# EAGLE design NIRGM V5 (EAGLE 8.5.1)

## Sheet 1 of 7: Voltage Regulator
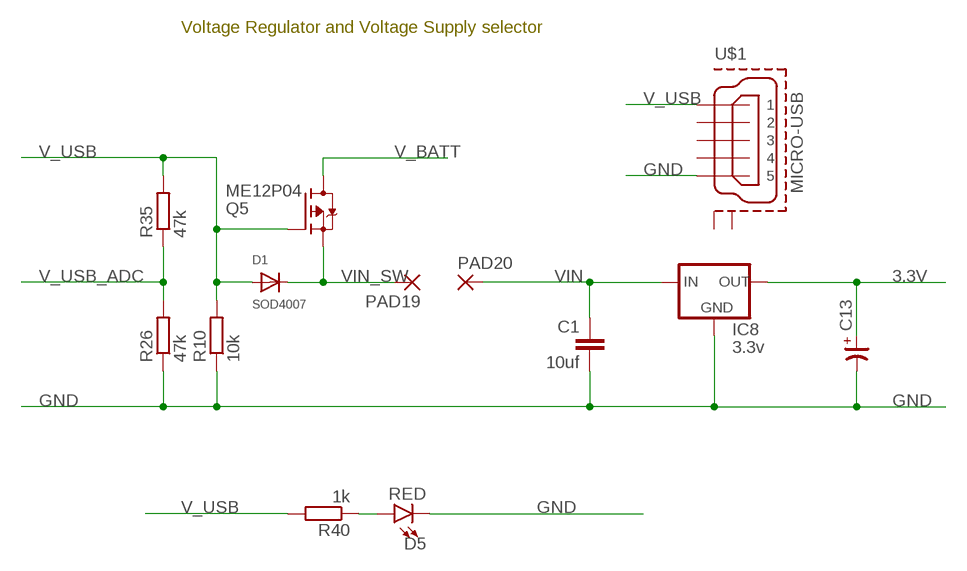
[diagram p0: schematic, sheet 1]

### Parts
C1  10uf  C-EUC1206K  [C1206K]
C13  CP-7343  [7343/T]
D1  SOD4007  DIODE_SOD-123FL  [SOD-123FL]
D5  RED  LED-GREEN1206  [LED-1206]
IC8  3.3v  LM1117TO252  [TO252]
PAD19  SMD2  [SMD1,27-2,54]
PAD20  SMD2  [SMD1,27-2,54]
Q5  ME12P04  FDD4141TO252  [TO252]
R10  10k  R-EU_R1206  [R1206]
R26  47k  R-EU_R1206  [R1206]
R35  47k  R-EU_R1206  [R1206]
R40  1k  R-EU_R1206  [R1206]
U$1  MICRO-USB  MICRO-USB-RECEPTACLE47589-0001  [47589-0001]

### Nets
3.3V: C13.+ IC8.3(OUT) ; also sheet 3,4,5,6,7
GND: C1.2 C13.- D5.C IC8.1(GND) R10.1 R26.1 U$1.5 ; also sheet 2,3,4,5,6,7
N$1: D5.A R40.1
V_BATT: Q5.3(D) ; also sheet 2,6
V_USB: D1.A Q5.1(G) R10.2 R35.2 R40.2 U$1.1 ; also sheet 2
V_USB_ADC: R26.2 R35.1 ; also sheet 4
VIN: C1.1 IC8.2(IN) PAD20.1(P)
VIN_SW: D1.C PAD19.1(P) Q5.2(S)
Unconnected: U$1.2 U$1.3 U$1.4 U$1.P$1(GND1) U$1.P$2(GND2)

### Notes on the sheet
- Voltage Regulator and Voltage Supply selector

## Sheet 2 of 7: Lithium-Polymer Battery Charger (1-cell)
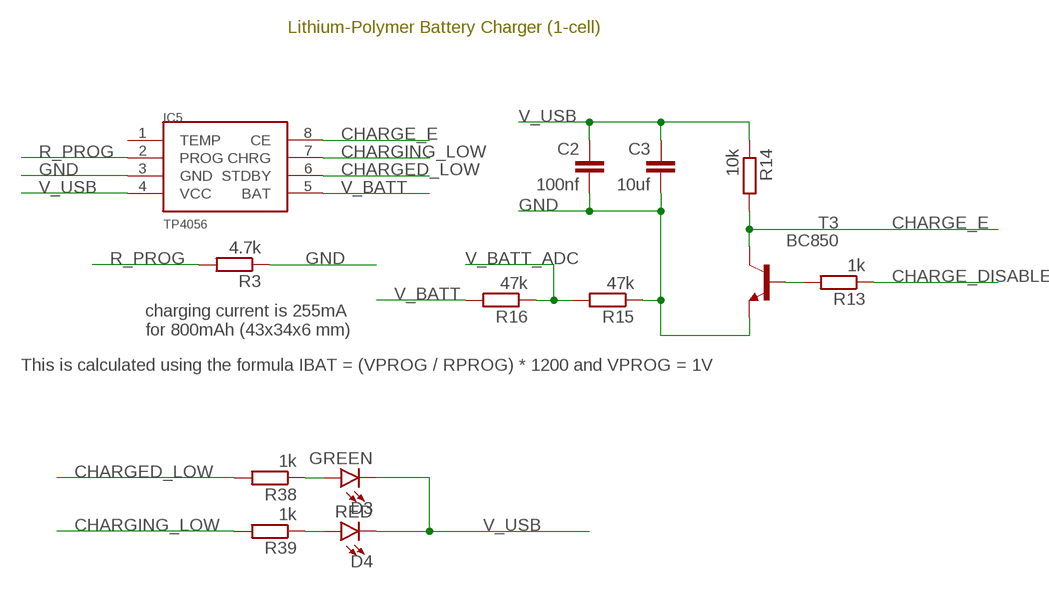
[diagram p1: schematic, sheet 2]

### Parts
C2  100nf  C-EUC1206K  [C1206K]
C3  10uf  C-EUC1206K  [C1206K]
D3  GREEN  LED-GREEN1206  [LED-1206]
D4  RED  LED-GREEN1206  [LED-1206]
IC5  TP4056  [SOP-8]
R3  4.7k  R-EU_R1206  [R1206]
R13  1k  R-EU_R1206  [R1206]
R14  10k  R-EU_R1206  [R1206]
R15  47k  R-EU_R1206  [R1206]
R16  47k  R-EU_R1206  [R1206]
R38  1k  R-EU_R1206  [R1206]
R39  1k  R-EU_R1206  [R1206]
T3  BC850  [SOT23]

### Nets
CHARGE_DISABLE: R13.1 ; also sheet 4
CHARGE_E: IC5.8(CE) R14.2 T3.3(C)
CHARGED_LOW: IC5.6(STDBY) R38.2 ; also sheet 4
CHARGING_LOW: IC5.7(CHRG) R39.2 ; also sheet 4
GND: C2.2 C3.2 IC5.3(GND) R3.1 R15.1 T3.2(E) ; also sheet 1,3,4,5,6,7
N$4: D3.A R38.1
N$6: D4.A R39.1
N$13: R13.2 T3.1(B)
R_PROG: IC5.2(PROG) R3.2
V_BATT: IC5.5(BAT) R16.2 ; also sheet 1,6
V_BATT_ADC: R15.2 R16.1 ; also sheet 4
V_USB: C2.1 C3.1 D3.C D4.C IC5.4(VCC) R14.1 ; also sheet 1
Unconnected: IC5.1(TEMP)

### Notes on the sheet
- Lithium-Polymer Battery Charger (1-cell)
- charging current is 255mA
  for 800mAh (43x34x6 mm)
- This is calculated using the formula IBAT = (VPROG / RPROG) * 1200 and VPROG = 1V

## Sheet 3 of 7: LED Driver
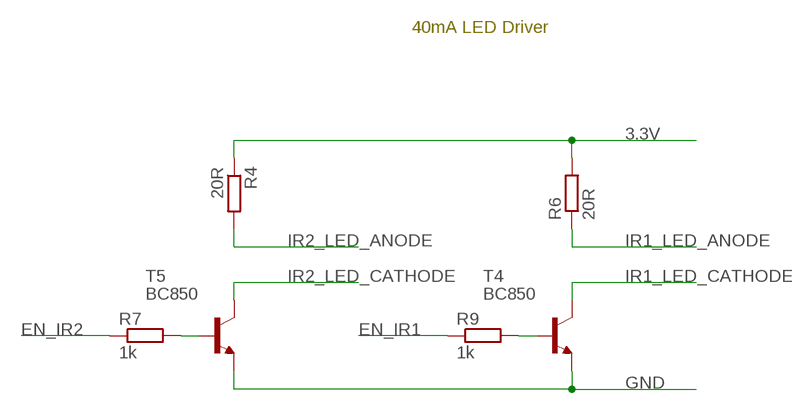
[diagram p2: schematic, sheet 3]

### Parts
R4  20R  R-EU_R1206  [R1206]
R6  20R  R-EU_R1206  [R1206]
R7  1k  R-EU_R1206  [R1206]
R9  1k  R-EU_R1206  [R1206]
T4  BC850  [SOT23]
T5  BC850  [SOT23]

### Nets
3.3V: R4.1 R6.2 ; also sheet 1,4,5,6,7
EN_IR1: R9.1 ; also sheet 4
EN_IR2: R7.1 ; also sheet 4
GND: T4.2(E) T5.2(E) ; also sheet 1,2,4,5,6,7
IR1_LED_ANODE: R6.1 ; also sheet 6
IR1_LED_CATHODE: T4.3(C) ; also sheet 6
IR2_LED_ANODE: R4.2 ; also sheet 6
IR2_LED_CATHODE: T5.3(C) ; also sheet 6
N$3: R7.2 T5.1(B)
N$8: R9.2 T4.1(B)

### Notes on the sheet
- 40mA LED Driver

## Sheet 4 of 7: ESP32
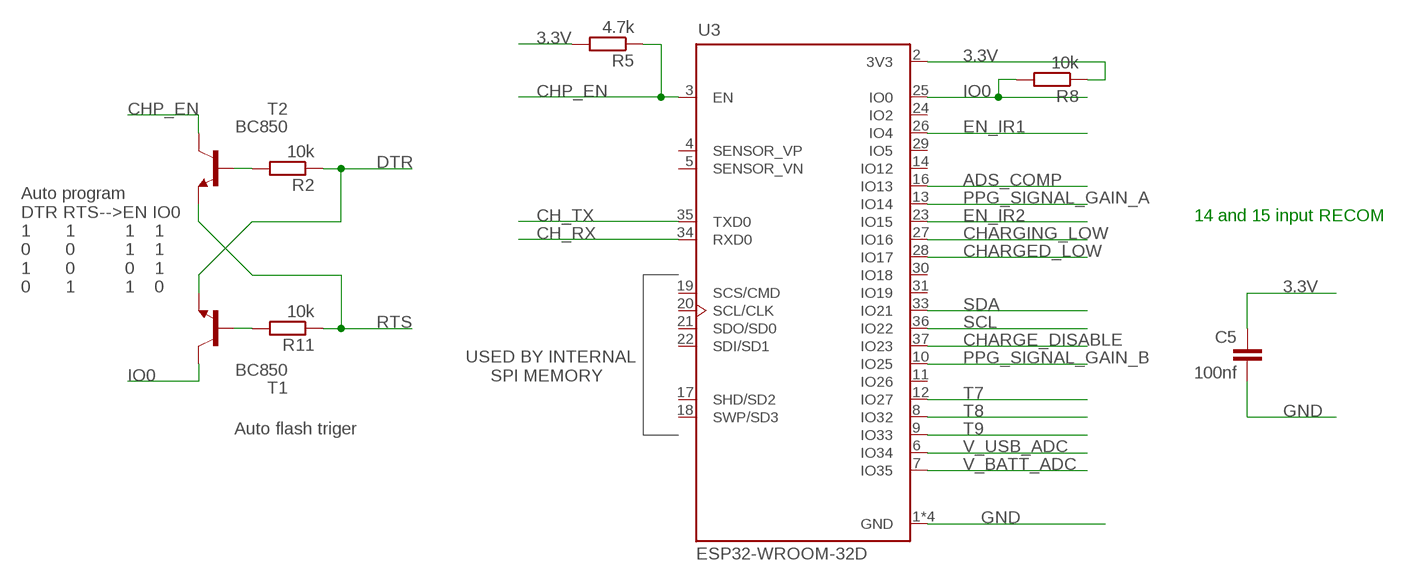
[diagram p3: schematic, sheet 4]

### Parts
C5  100nf  C-EUC1206K  [C1206K]
R2  10k  R-EU_R1206  [R1206]
R5  4.7k  R-EU_R1206  [R1206]
R8  10k  R-EU_R1206  [R1206]
R11  10k  R-EU_R1206  [R1206]
T1  BC850  [SOT23]
T2  BC850  [SOT23]
U3  ESP32-WROOM-32D  [MODULE_ESP32-WROOM-32D]

### Nets
3.3V: C5.1 R5.2 R8.1 U3.2(3V3) ; also sheet 1,3,5,6,7
ADS_COMP: U3.16(IO13) ; also sheet 7
CH_RX: U3.34(RXD0) ; also sheet 6
CH_TX: U3.35(TXD0) ; also sheet 6
CHARGE_DISABLE: U3.37(IO23) ; also sheet 2
CHARGED_LOW: U3.28(IO17) ; also sheet 2
CHARGING_LOW: U3.27(IO16) ; also sheet 2
CHP_EN: R5.1 T2.3(C) U3.3(EN) ; also sheet 6
DTR: R2.1 T1.2(E) ; also sheet 6
EN_IR1: U3.26(IO4) ; also sheet 3
EN_IR2: U3.23(IO15) ; also sheet 3
GND: C5.2 U3.1(GND) U3.15(GND) U3.38(GND) U3.39(GND) ; also sheet 1,2,3,5,6,7
IO0: R8.2 T1.3(C) U3.25(IO0) ; also sheet 6
N$5: R11.2 T1.1(B)
N$18: R2.2 T2.1(B)
PPG_SIGNAL_GAIN_A: U3.13(IO14) ; also sheet 5
PPG_SIGNAL_GAIN_B: U3.10(IO25) ; also sheet 5
RTS: R11.1 T2.2(E) ; also sheet 6
SCL: U3.36(IO22) ; also sheet 6,7
SDA: U3.33(IO21) ; also sheet 6,7
T7: U3.12(IO27) ; also sheet 6
T8: U3.8(IO32) ; also sheet 6
T9: U3.9(IO33) ; also sheet 6
V_BATT_ADC: U3.7(IO35) ; also sheet 2
V_USB_ADC: U3.6(IO34) ; also sheet 1
Unconnected: U3.4(SENSOR_VP) U3.5(SENSOR_VN) U3.11(IO26) U3.14(IO12) U3.17(SHD/SD2) U3.18(SWP/SD3) U3.19(SCS/CMD) U3.20(SCL/CLK) U3.21(SDO/SD0) U3.22(SDI/SD1) U3.24(IO2) U3.29(IO5) U3.30(IO18) U3.31(IO19)

### Notes on the sheet
- 14 and 15 input RECOM
- Auto program
  DTR RTS-->EN IO0 
  1       1          1    1
  0       0          1    1
  1       0          0    1
  0       1          1    0
- USED BY INTERNAL
       SPI MEMORY
- Auto flash triger

## Sheet 5 of 7: Programable gain amplifier
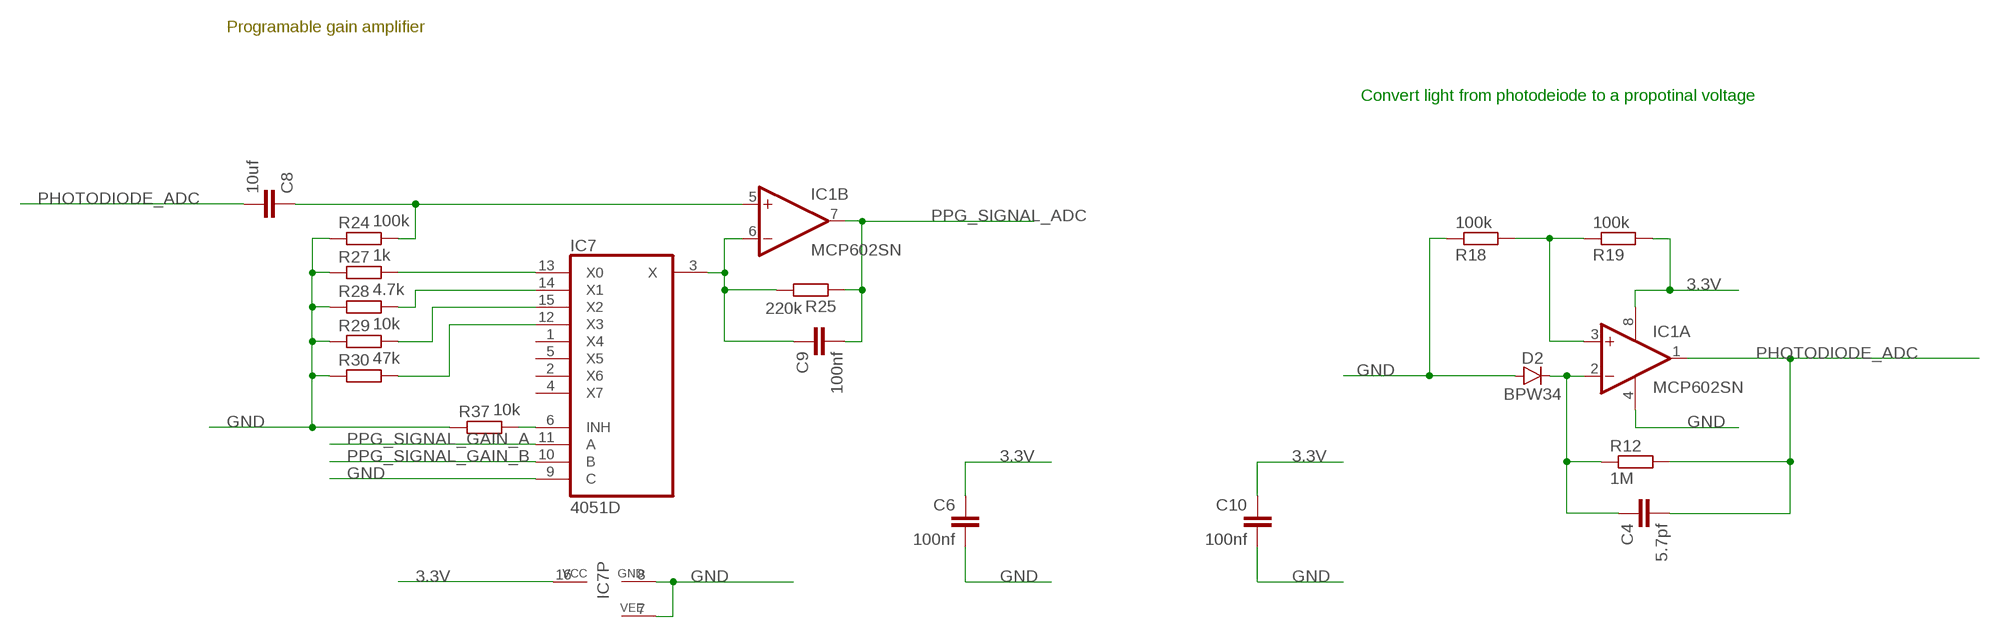
[diagram p4: schematic, sheet 5]

### Parts
C4  5.7pf  C-EUC1206K  [C1206K]
C6  100nf  C-EUC1206K  [C1206K]
C8  10uf  C-EUC1206K  [C1206K]
C9  100nf  C-EUC1206K  [C1206K]
C10  100nf  C-EUC1206K  [C1206K]
D2  BPW34  [BPW34]
IC1  MCP602SN  [SO08]
IC7  4051D  [SO16]
R12  1M  R-EU_R1206  [R1206]
R18  100k  R-EU_R1206  [R1206]
R19  100k  R-EU_R1206  [R1206]
R24  100k  R-EU_R1206  [R1206]
R25  220k  R-EU_R1206  [R1206]
R27  1k  R-EU_R1206  [R1206]
R28  4.7k  R-EU_R1206  [R1206]
R29  10k  R-EU_R1206  [R1206]
R30  47k  R-EU_R1206  [R1206]
R37  10k  R-EU_R1206  [R1206]

### Nets
3.3V: C6.1 C10.1 IC1.8(P:V+) IC7.16(VCC) R19.2 ; also sheet 1,3,4,6,7
GND: C6.2 C10.2 D2.P$1(A) IC1.4(P:V-) IC7.7(VEE) IC7.8(GND) IC7.9(C) R18.1 R24.1 R27.1 R28.1 R29.1 R30.1 R37.1 ; also sheet 1,2,3,4,6,7
N$7: C4.1 D2.P$2(C) IC1.2(A:-IN) R12.1
N$10: IC1.3(A:+IN) R18.2 R19.1
N$11: IC7.6(INH) R37.2
N$29: C8.1 IC1.5(B:+IN) R24.2
N$39: C9.1 IC1.6(B:-IN) IC7.3(X) R25.2
N$40: IC7.13(X0) R27.2
N$41: IC7.14(X1) R28.2
N$42: IC7.15(X2) R29.2
N$43: IC7.12(X3) R30.2
PHOTODIODE_ADC: C4.2 C8.2 IC1.1(A:OUT) R12.2 ; also sheet 7
PPG_SIGNAL_ADC: C9.2 IC1.7(B:OUT) R25.1 ; also sheet 7
PPG_SIGNAL_GAIN_A: IC7.11(A) ; also sheet 4
PPG_SIGNAL_GAIN_B: IC7.10(B) ; also sheet 4
Unconnected: IC7.1(X4) IC7.2(X6) IC7.4(X7) IC7.5(X5)

### Notes on the sheet
- Programable gain amplifier
- Convert light from photodeiode to a propotinal voltage

## Sheet 6 of 7: OLED LCD and Connectors
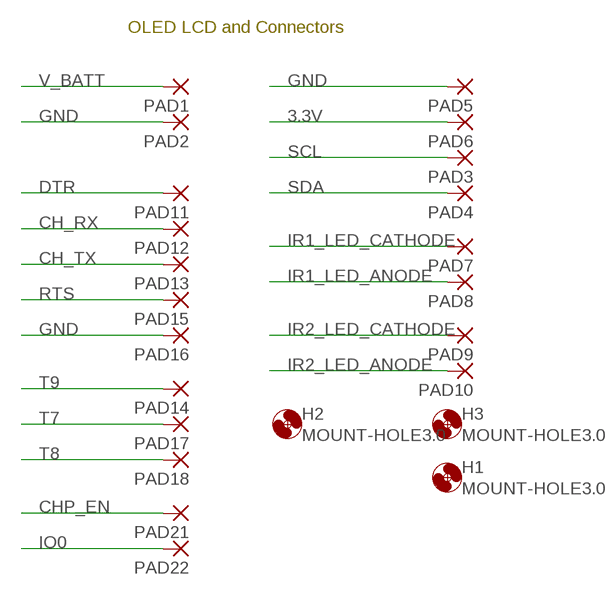
[diagram p5: schematic, sheet 6]

### Parts
H1  MOUNT-HOLE3.0  [3,0]
H2  MOUNT-HOLE3.0  [3,0]
H3  MOUNT-HOLE3.0  [3,0]
PAD1  WIREPADSMD5-2,5  [5-2,5]
PAD2  WIREPADSMD5-2,5  [5-2,5]
PAD3  SMD2  [SMD1,27-2,54]
PAD4  SMD2  [SMD1,27-2,54]
PAD5  SMD2  [SMD1,27-2,54]
PAD6  SMD2  [SMD1,27-2,54]
PAD7  SMD2  [SMD1,27-2,54]
PAD8  SMD2  [SMD1,27-2,54]
PAD9  SMD2  [SMD1,27-2,54]
PAD10  SMD2  [SMD1,27-2,54]
PAD11  SMD2  [SMD1,27-2,54]
PAD12  SMD2  [SMD1,27-2,54]
PAD13  SMD2  [SMD1,27-2,54]
PAD14  SMD2  [SMD1,27-2,54]
PAD15  SMD2  [SMD1,27-2,54]
PAD16  SMD2  [SMD1,27-2,54]
PAD17  SMD2  [SMD1,27-2,54]
PAD18  SMD2  [SMD1,27-2,54]
PAD21  SMD2  [SMD1,27-2,54]
PAD22  SMD2  [SMD1,27-2,54]

### Nets
3.3V: PAD6.1(P) ; also sheet 1,3,4,5,7
CH_RX: PAD12.1(P) ; also sheet 4
CH_TX: PAD13.1(P) ; also sheet 4
CHP_EN: PAD21.1(P) ; also sheet 4
DTR: PAD11.1(P) ; also sheet 4
GND: PAD2.1(P) PAD5.1(P) PAD16.1(P) ; also sheet 1,2,3,4,5,7
IO0: PAD22.1(P) ; also sheet 4
IR1_LED_ANODE: PAD8.1(P) ; also sheet 3
IR1_LED_CATHODE: PAD7.1(P) ; also sheet 3
IR2_LED_ANODE: PAD10.1(P) ; also sheet 3
IR2_LED_CATHODE: PAD9.1(P) ; also sheet 3
RTS: PAD15.1(P) ; also sheet 4
SCL: PAD3.1(P) ; also sheet 4,7
SDA: PAD4.1(P) ; also sheet 4,7
T7: PAD17.1(P) ; also sheet 4
T8: PAD18.1(P) ; also sheet 4
T9: PAD14.1(P) ; also sheet 4
V_BATT: PAD1.1(P) ; also sheet 1,2

### Notes on the sheet
- OLED LCD and Connectors

## Sheet 7 of 7: ADS1115
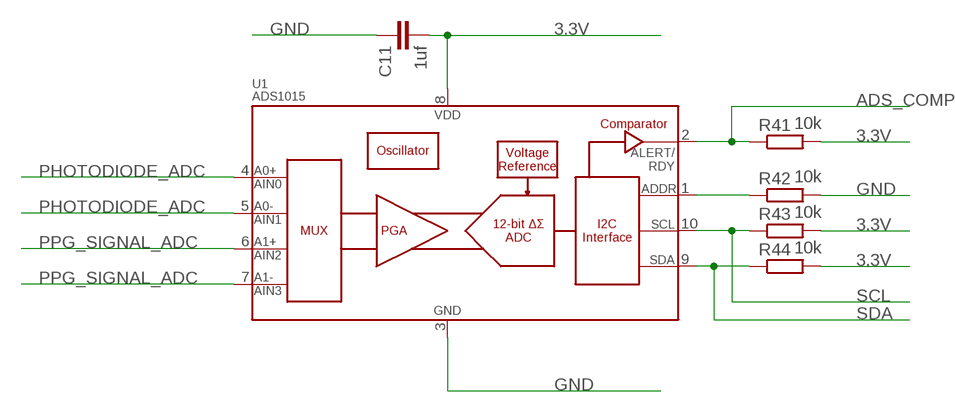
[diagram p6: schematic, sheet 7]

### Parts
C11  1uf  C-EUC1206K  [C1206K]
R41  10k  R-EU_R1206  [R1206]
R42  10k  R-EU_R1206  [R1206]
R43  10k  R-EU_R1206  [R1206]
R44  10k  R-EU_R1206  [R1206]
U1  ADS1015  [MSOP10]

### Nets
3.3V: C11.2 R41.2 R43.2 R44.2 U1.8(VDD) ; also sheet 1,3,4,5,6
ADS_COMP: R41.1 U1.2(ALERT/RDY) ; also sheet 4
GND: C11.1 R42.2 U1.3(VSS) ; also sheet 1,2,3,4,5,6
N$9: R42.1 U1.1(ADDR)
PHOTODIODE_ADC: U1.4(AIN0) U1.5(AIN1) ; also sheet 5
PPG_SIGNAL_ADC: U1.6(AIN2) U1.7(AIN3) ; also sheet 5
SCL: R43.1 U1.10(SCL) ; also sheet 4,6
SDA: R44.1 U1.9(SDA) ; also sheet 4,6

## Library data of the parts
C1-C6 C8-C11 = rcl:C-EU: CAPACITOR, European symbol; SPICEPREFIX: C
C13 = cap-master:CP-: POLARIZED CAP
D1 = adafruit:DIODE: Diode SMADIODE - SMA Surface Mount Package 20V 1A Schottky Diode Digikey: 641-1014-6-ND DO-1N4148 - Through Hole Small Current Diode SOD-123 20V 1 A (.5mV Vf) Schottky Diode - Digikey: MBRX120TPMSCT-ND SOD-323 10V 570mA (.38mV Vf, 3ns) Schottky Diode - Digikey: ZLLS410CT-ND SOD-523 30V 30mA Schottky Diode (RB751S-40TE61) - Digikey: RB751S-40TE61CT-ND SOT23-R/W - SOT23 Package (R = Solder Paste/Reflow Ovens, W = Hand-Soldering) BAT54Film 40V 300mA - Digikey: 497-7162-1-ND
D2 = SparkFun-Sensors:BPW34: Vishay BPW34 Silicon PIN Photodiode (Miniature Solar Cell) BPW34 is a PIN photodiode with high speed and high radiant sensitivity in miniature, flat, top view, clear plastic package. It is sensitive to visible and near infrared radiation. BPW34S is packed in tubes, specifications like BPW34. Datasheet: https://www.sparkfun.com/datasheets/Prototyping/Solar/bpw34.pdf SparkFun Products Miniature Solar Cell - BPW34 <https://www.sparkfun.com/products/9541> (PRT-09541); SF_ID: PRT-09541
D3 = SparkFun-LED:LED-GREEN: Green SMD LED Used in manufacturing of various products at SparkFun Packages: 0603 - SMD 0603 package [Product Link] <http://www.futureelectronics.com/en/technologies/semiconductors/optoelectronics/leds/Pages/9894312-LTST-C190GKT.aspx?CrossPart=HSMG-C190&IM=0> LilyPad 1206 - SMD1206 LilyPad package [Product Link] <http://www.futureelectronics.com/en/Technologies/Product.aspx?ProductID=IN150NGHARVATEKCORPORATION2049943&IM=0> 1206 - SMD1206 package [Product Link] <http://www.futureelectronics.com/en/technologies/semiconductors/optoelectronics/leds/Pages/8315665-LTST-C150KGKT.aspx?IM=0> 1206 Bottom Mount -SMD 1206 Bottom Mount [Product Link] <http://www.digikey.com/product-detail/en/lite-on-inc/LTST-C230KGKT/160-1456-1-ND/386854> SparkFun Products: Pro Mini 328 -5V <https://www.sparkfun.com/products/821> RedBoard <https://www.sparkfun.com/products/12757> MP3 Trigger <https://www.sparkfun.com/products/13720> Makey Makey <https://www.sparkfun.com/products/11076>; PROD_ID: DIO-00862
D4 D5 = SparkFun-LED:LED-GREEN: Green SMD LED Used in manufacturing of various products at SparkFun Packages: 0603 - SMD 0603 package [Product Link] <http://www.futureelectronics.com/en/technologies/semiconductors/optoelectronics/leds/Pages/9894312-LTST-C190GKT.aspx?CrossPart=HSMG-C190&IM=0> LilyPad 1206 - SMD1206 LilyPad package [Product Link] <http://www.futureelectronics.com/en/Technologies/Product.aspx?ProductID=IN150NGHARVATEKCORPORATION2049943&IM=0> 1206 - SMD1206 package [Product Link] <http://www.futureelectronics.com/en/technologies/semiconductors/optoelectronics/leds/Pages/8315665-LTST-C150KGKT.aspx?IM=0> 1206 Bottom Mount -SMD 1206 Bottom Mount [Product Link] <http://www.digikey.com/product-detail/en/lite-on-inc/LTST-C230KGKT/160-1456-1-ND/386854> SparkFun Products: Pro Mini 328 -5V <https://www.sparkfun.com/products/821> RedBoard <https://www.sparkfun.com/products/12757> MP3 Trigger <https://www.sparkfun.com/products/13720> Makey Makey <https://www.sparkfun.com/products/11076>; PROD_ID: DIO-00862; VALUE: GREEN
H1-H3 = holes:MOUNT-HOLE: MOUNTING HOLE with drill center marker
IC1 = linear:MCP602: Single Op Amp 2.7V to 6.0V Single Supply CMOS Source: http://ww1.microchip.com/downloads/en/DeviceDoc/21314g.pdf
IC5 = TP4056:TP4056
IC7 = 40xx:4051: 8-channel ANALOG MULTIPLEXER
IC8 = v-reg-2:LM1117
PAD1 PAD2 = wirepad:WIREPAD: Wire PAD connect wire on PCB
PAD3-PAD22 = wirepad:SMD2: SMD PAD
Q5 = transistor-fet:FDD4141: P-Channel PowerTrench® MOSFET Source: FDD4141.pdf
R2-R16 R18 R19 R24-R30 R35 R37-R44 = rcl:R-EU_: RESISTOR, European symbol; SPICEPREFIX: R
T1-T5 = transistor:BC850: NPN TRANSISTOR
U1 = SparkFun-IC-Conversion:ADS1015: ADS1015 12-BIT ADC 12-Bit Del-Sig ADC Four single-ended inputs or two differential inputs Internal PGA I2C interface 2.0-5.5V SparkFun Products SparkFun Block for Intel Edison - ADC <https://www.sparkfun.com/products/13770> (DEV-13770); PROD_ID: IC-12270
U3 = ESP32-WROOM-32DMODED:ESP32-WROOM-32D: IC: SoC; GPIO, I2C, I2S, IR, SD, SDIO, SPI, UART; 2.7÷3.6VDC; 20dBm; AVAILABILITY: Unavailable; DESCRIPTION: IC: SoC; GPIO, I2C, I2S, IR, SD, SDIO, SPI, UART; 2.7÷3.6VDC; 20dBm; MF: Espressif Systems; MP: ESP32-WROOM-32D; PACKAGE: Module Espressif Systems; PRICE: None
U$1 = con-molex-usb:MICRO-USB-RECEPTACLE: MICRO USB RECEPTACLES Micro-USB Receptacles, SMT, Lead-Free from MOLEX <http://www.molex.com/>. (C) 2014 Tomasz Boleslaw CEDRO, cederom@tlen.pl, http://www.tomek.cedro.info. Version 0.1 (2014-01-17): Initial release. Version 0.2 (2014-02-06): Updated 47589-0001 footprint pins/pads/milling. Following devices are included: 1. 47589-0001 Micro-USB AB Receptacle, Bottom Mount, SMT, Lead-Free <http://www.molex.com/molex/products/datasheet.jsp?part=active/0475890001_IO_CONNECTORS.xml> (Technical Drawing <http://www.molex.com/pdm_docs/sd/475890001_sd.pdf>).

## Board
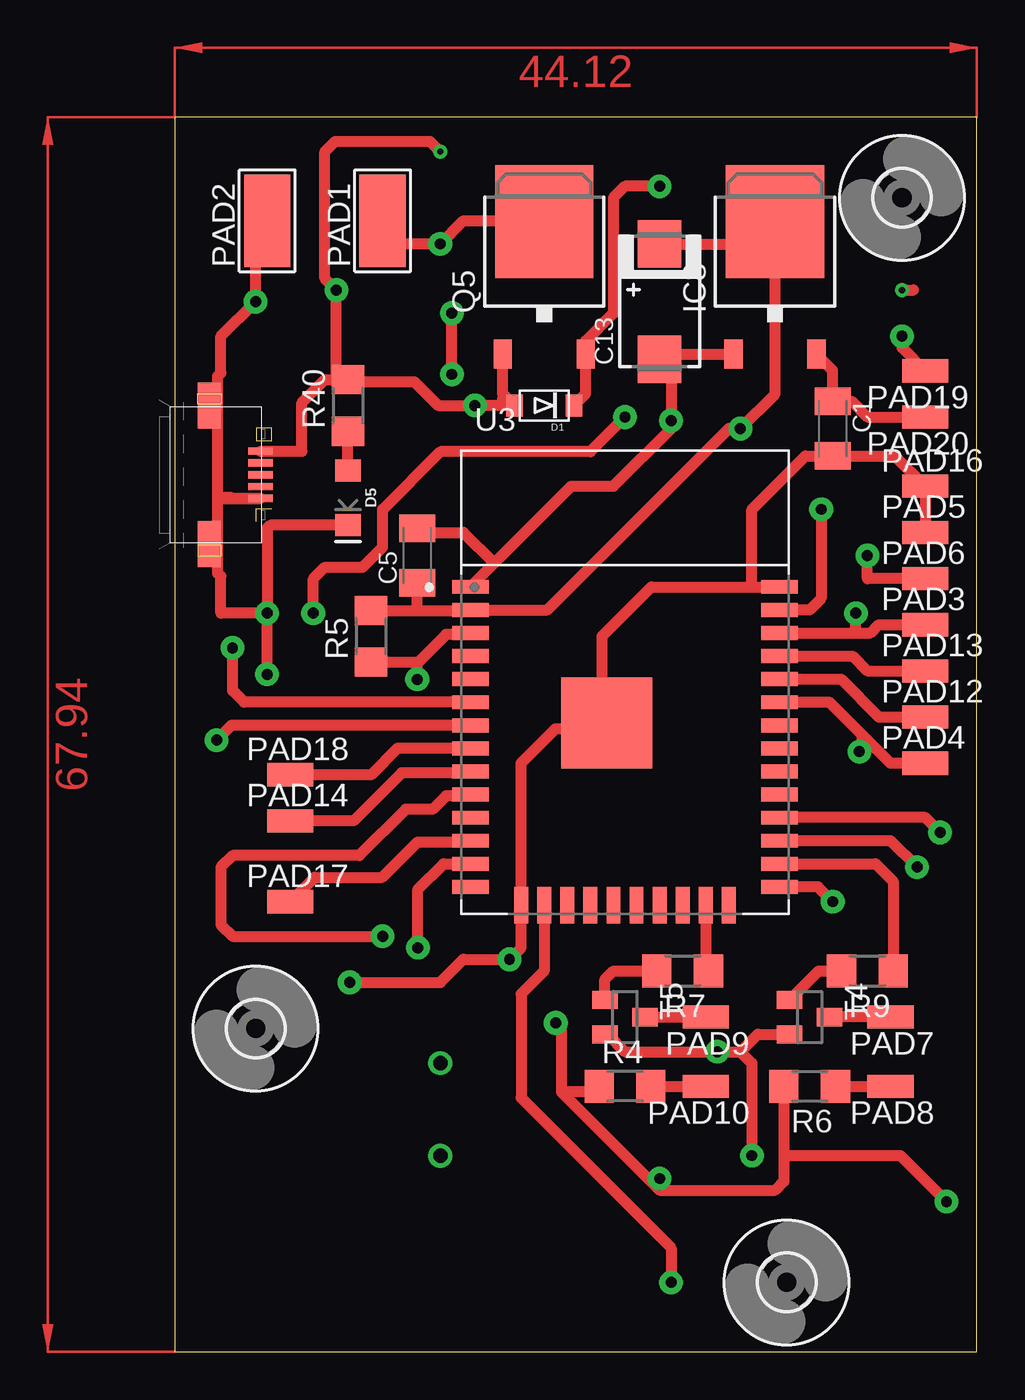
[diagram p7: board, top side]
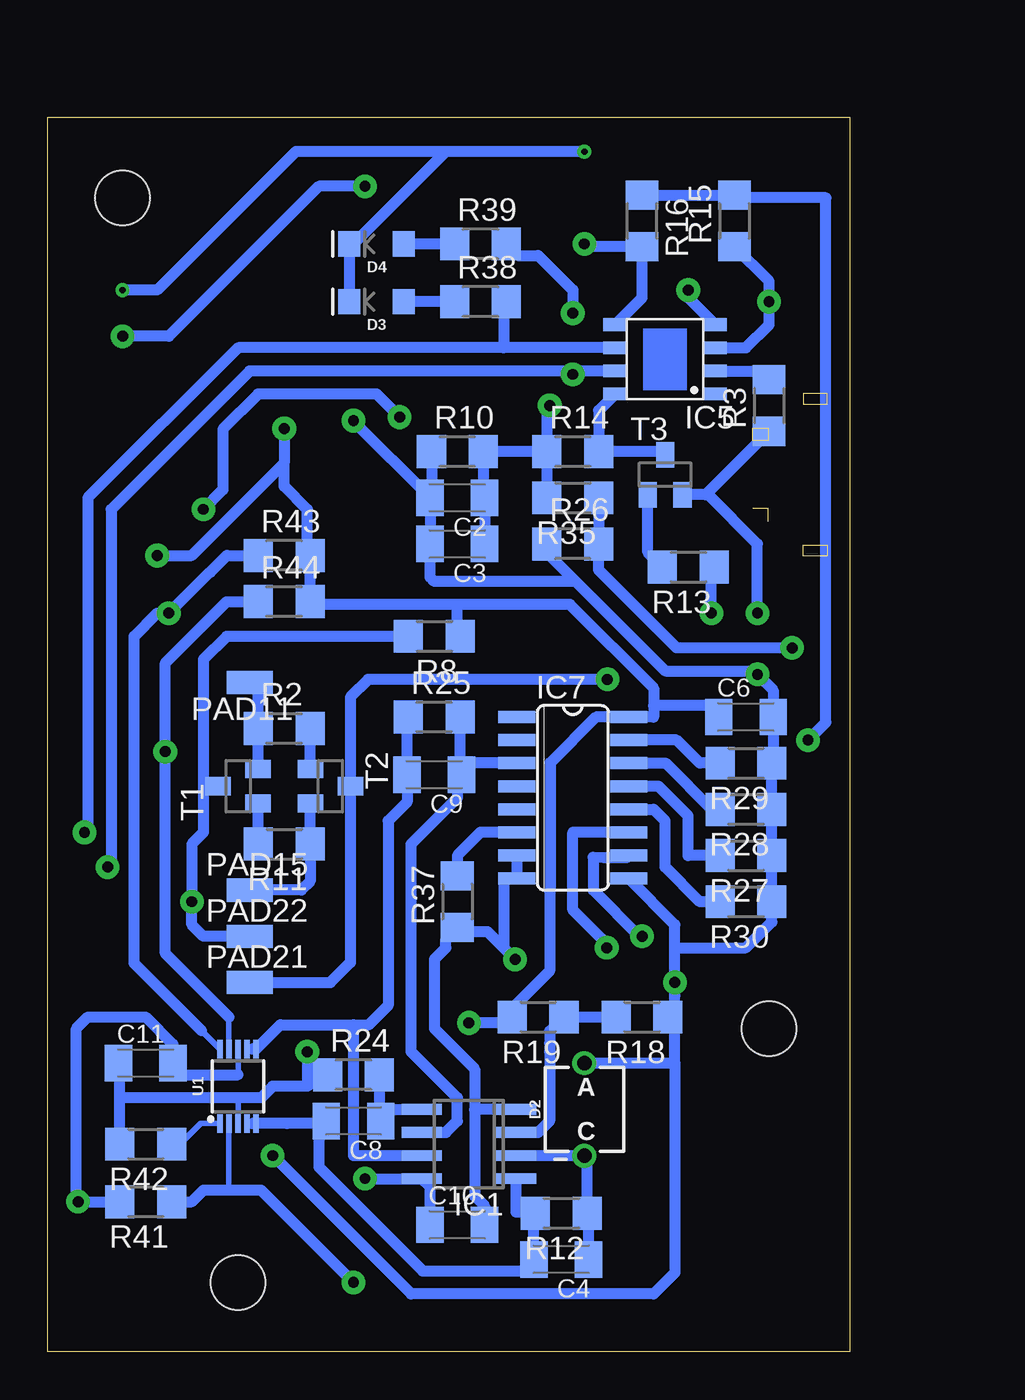
[diagram p8: board, bottom side, seen from below]

Size 44.12 x 67.94 mm. Coordinates in mm from the lower left corner, seen from the top.
Outline: 0,0 44.12,0 44.12,67.94 0,67.94 0,0
Copper layers (1*16): Top 0.035mm / dielectric 1.5mm / Bottom 0.035mm
Design rules "default *": minimum track width 6mil, minimum drill 0.35mm, track to track 12mil, track to pad 12mil, pad to pad 6mil, via to via 6mil, smd to smd 6mil, copper to edge 40mil, drill to drill 6mil, minimum pad ring 10mil, minimum via ring 8mil, stop-mask expansion 4mil, vias tented up to drill 0mil, thermal gap 10mil

### Footprints (pad centres in the part's own frame; a part is rotated, then mirrored left to right if it is on the bottom)
C1206K = smd 1.5 x 2: 1 -1.5,0; 2 1.5,0
7343/T = smd 2.6 x 2.4: + 3.175,0; - -3.175,0
SOD-123FL = smd 0.91 x 1.22: A 1.637,0; C -1.637,0
BPW34 = drill 0.8: P$1 0,2.55; P$2 0,-2.55
LED-1206 = smd 1.2 x 1.4: A -1.5,0; C 1.5,0
3,0 = hole 3: 0,0
SO08 = smd 0.6 x 2.2: 1 -1.905,-2.6; 2 -0.635,-2.6; 3 0.635,-2.6; 4 1.905,-2.6; 5 1.905,2.6; 6 0.635,2.6; 7 -0.635,2.6; 8 -1.905,2.6
SOP-8 = smd 1.3 x 0.7: 1 -2.75,1.905; 2 -2.75,0.635; 3 -2.75,-0.635; 4 -2.75,-1.905; 5 2.75,-1.905; 6 2.75,-0.635; 7 2.75,0.635; 8 2.75,1.905
SO16 = smd 0.66 x 2.032: 1 -4.445,-3.073; 2 -3.175,-3.073; 3 -1.905,-3.073; 4 -0.635,-3.073; 5 0.635,-3.073; 6 1.905,-3.073; 7 3.175,-3.073; 8 4.445,-3.073; 9 4.445,3.073; 10 3.175,3.073; 11 1.905,3.073; 12 0.635,3.073; 13 -0.635,3.073; 14 -1.905,3.073; 15 -3.175,3.073; 16 -4.445,3.073
TO252 = smd 1 x 1.6: 1 -2.28,-6.07; 2 2.28,-6.07 | smd 5.4 x 6.2: 3 0,1.23
5-2,5 = smd 2.54 x 5.08: 1 0,0
SMD1,27-2,54 = smd 1.27 x 2.54: 1 0,0
TO252' = smd 1 x 1.6: 1 -2.28,-4.8; 2 2.28,-4.8 | smd 5.4 x 6.2: 3 0,2.5
R1206 = smd 1.6 x 1.803: 1 -1.422,0; 2 1.422,0
SOT23 = smd 1 x 1.4: 1 -0.95,-1.1; 2 0.95,-1.1; 3 0,1.1
MSOP10 = smd 0.3 x 1: 1 -1,-2.05; 2 -0.5,-2.05; 3 0,-2.05; 4 0.5,-2.05; 5 1,-2.05; 6 1,2.05; 7 0.5,2.05; 8 0,2.05; 9 -0.5,2.05; 10 -1,2.05
MODULE_ESP32-WROOM-32D = smd 2 x 0.762: 1 -8.5,5.26; 2 -8.5,3.99; 3 -8.5,2.72; 4 -8.5,1.45; 5 -8.5,0.18; 6 -8.5,-1.09; 7 -8.5,-2.36; 8 -8.5,-3.63; 9 -8.5,-4.9; 10 -8.5,-6.17; 11 -8.5,-7.44; 12 -8.5,-8.71; 13 -8.5,-9.98; 14 -8.5,-11.25; 25 8.5,-11.25; 26 8.5,-9.98; 27 8.5,-8.71; 28 8.5,-7.44; 29 8.5,-6.17; 30 8.5,-4.9; 31 8.5,-3.63; 32 8.5,-2.36; 33 8.5,-1.09; 34 8.5,0.18; 35 8.5,1.45; 36 8.5,2.72; 37 8.5,3.99; 38 8.5,5.26 | smd 0.762 x 2: 15 -5.715,-12.25; 16 -4.445,-12.25; 17 -3.175,-12.25; 18 -1.905,-12.25; 19 -0.635,-12.25; 20 0.635,-12.25; 21 1.905,-12.25; 22 3.175,-12.25; 23 4.445,-12.25; 24 5.715,-12.25 | smd 5 x 5: 39 -1,-2.24
47589-0001 = smd 1.35 x 0.4: 1 2.8,1.3; 2 2.8,0.65; 3 2.8,0; 4 2.8,-0.65; 5 2.8,-1.3 | smd 1.27 x 2.54: P$1 0,3.81; P$2 0,-3.81

### Placement (x,y rotation side)
C1  36.2,50.8 270 top
C2  21.59,46.99 180 bottom
C3  21.59,44.45 180 bottom
C4  15.88,5.08 180 bottom
C5  13.34,43.81 90 top
C6  5.71,34.92 0 bottom
C8  27.3,12.7 180 bottom
C9  22.86,31.75 180 bottom
C10  21.59,6.99 0 bottom
C11  38.73,15.88 0 bottom
C13  26.67,57.78 90 top
D1  20.32,52.07 180 top
D2  14.61,13.34 0 bottom
D3  26.04,57.78 180 bottom
D4  26.04,60.96 180 bottom
D5  9.53,46.99 270 top
H1  40.01,63.5 0 top
H2  4.45,17.78 0 top
H3  33.66,3.81 0 top
IC1  20.95,11.43 90 bottom
IC5  10.16,54.61 180 bottom
IC7  15.24,30.48 270 bottom
IC8  33.02,60.96 0 top
PAD1  11.43,62.23 0 top
PAD2  5.08,62.23 0 top
PAD3  41.27,40.01 270 top
PAD4  41.27,32.38 270 top
PAD5  41.27,45.09 270 top
PAD6  41.27,42.55 270 top
PAD7  39.37,18.41 90 top
PAD8  39.37,14.61 90 top
PAD9  29.21,18.41 90 top
PAD10  29.21,14.61 90 top
PAD11  33.02,36.83 90 bottom
PAD12  41.27,34.92 270 top
PAD13  41.27,37.47 270 top
PAD14  6.35,29.21 270 top
PAD15  33.02,25.4 270 bottom
PAD16  41.27,47.62 270 top
PAD17  6.35,24.77 270 top
PAD18  6.35,31.75 270 top
PAD19  41.27,53.98 90 top
PAD20  41.27,51.44 90 top
PAD21  33.02,20.32 270 bottom
PAD22  33.02,22.86 270 bottom
Q5  ME12P04  [TO252']  20.32,59.69 0 top
R2  31.11,34.29 0 bottom
R3  4.45,52.07 90 bottom
R4  24.77,14.61 0 top
R5  10.79,39.37 90 top
R6  34.92,14.61 180 top
R7  27.94,20.95 180 top
R8  22.86,39.37 180 bottom
R9  38.1,20.95 180 top
R10  21.59,49.53 0 bottom
R11  31.11,27.94 180 bottom
R12  15.88,7.62 180 bottom
R13  8.89,43.18 180 bottom
R14  15.24,49.53 0 bottom
R15  6.35,62.23 90 bottom
R16  11.43,62.23 270 bottom
R18  11.43,18.41 180 bottom
R19  17.14,18.41 180 bottom
R24  27.3,15.24 0 bottom
R25  22.86,34.92 0 bottom
R26  15.24,44.45 0 bottom
R27  5.71,27.3 180 bottom
R28  5.71,29.84 180 bottom
R29  5.71,32.38 180 bottom
R30  5.71,24.77 180 bottom
R35  15.24,46.99 180 bottom
R37  21.59,24.77 90 bottom
R38  20.32,57.78 0 bottom
R39  20.32,60.96 0 bottom
R40  9.53,52.07 90 top
R41  38.73,8.26 180 bottom
R42  38.73,11.43 180 bottom
R43  31.11,43.81 0 bottom
R44  31.11,41.27 0 bottom
T1  33.66,31.11 90 bottom
T2  28.57,31.11 270 bottom
T3  10.16,48.26 0 bottom
T4  34.92,18.41 270 top
T5  24.77,18.41 270 top
U1  33.66,14.61 0 bottom
U3  24.77,36.83 0 top
U$1  1.91,48.26 0 top

### Tracks (layer width: path | path; a pad name or v marks a point on that pad's centre or on a via)
3.3V  (via drill 0.6 pad 1.3)
  Top 0.61: IC8.3 33.02,52.7 v31.11,50.8 30.48,50.8 20.5,40.82 U3.2 16.24,40.79 13.34,40.79 | IC8.3 32.12,63.09 | R5.2 13.34,40.79 | PAD6.1 38.1,42.55 v38.1,43.81 | v42.45,8.26 39.91,10.79 33.66,10.79 33.5,10.95 | R4.1 23.03,14.29 21.27,14.29 | R6.2 33.5,10.95 | 21.27,14.29 26.04,9.53 | 26.04,9.53 26.67,8.89 33.02,8.89 33.5,9.37 33.5,10.95 | v20.95,18.09 21.27,17.78 21.27,14.29 | 26.04,9.53 v26.67,9.53 | 13.34,40.79 C5.1 | C13.+ 31.75,60.96 32.98,62.19 IC8.3
  Bottom 0.305: 33.66,15.24 U1.8
  Bottom 0.61: v31.11,50.8 31.11,48.9 | v38.1,43.81 36.2,43.81 31.11,48.9 | R41.2 v42.45,8.26 42.55,8.35 42.55,17.78 41.91,18.41 38.73,18.41 37.23,16.91 C11.2 36.6,15.24 33.66,15.24 | 10.79,35.56 10.79,36.52 15.39,41.12 21.59,41.12 | 10.79,35.56 10.79,34.92 IC7.16 13.97,34.92 16.48,32.41 16.48,25.37 16.51,25.34 16.51,20.95 18.73,18.73 18.57,18.57 R19.2 18.89,18.09 v20.95,18.09 | v26.67,9.53 IC1.8 23.09,9.06 C10.1 | C6.1 7.85,35.56 10.79,35.56 | 21.59,41.12 29.54,41.12 R44.2 R43.2 29.84,43.97 29.84,46.35 31.11,47.62 31.11,48.9 | R8.1 21.59,39.52 21.59,41.12
ADS_COMP  (via drill 0.6 pad 1.3)
  Top 0.61: U3.16 20.32,20.95 19.05,19.68 19.05,13.97 27.3,5.71 v27.3,3.81
  Bottom 0.305: 34.29,8.89 34.16,9.03 U1.2
  Bottom 0.61: R41.1 36.2,8.26 35.56,8.89 34.29,8.89 32.38,8.89 v27.3,3.81
CH_RX
  Top 0.61: U3.34 36.65,37.01 38.73,34.92 PAD12.1
CH_TX
  Top 0.61: U3.35 37.28,38.28 38.1,37.47 PAD13.1
CHARGE_DISABLE  (via drill 0.6 pad 1.3)
  Top 0.61: v24.77,51.44 22.86,49.53 14.61,49.53 11.43,46.35 11.43,44.28 10.33,43.18 8.26,43.18 7.62,42.55 v7.62,40.64 | U3.37 34.92,40.82 35.56,41.45 v35.56,46.35
  Bottom 0.61: v7.62,40.64 7.62,43.18 R13.1 | v35.56,46.35 34.48,47.43 34.48,50.77 32.55,52.7 26.04,52.7 v24.77,51.44
CHARGE_E
  Bottom 0.61: T3.3 10.33,49.53 R14.2 13.82,51.8 IC5.8
CHARGED_LOW  (via drill 0.6 pad 1.3)
  Top 0.61: 41.91,28.57 v42.1,28.57 41.29,29.39 U3.28
  Bottom 0.61: IC5.6 19.05,55.24 | 19.05,55.24 33.66,55.24 41.91,46.99 41.91,28.57 42.1,28.77 v42.1,28.57 | R38.2 19.05,57.63 19.05,55.24
CHARGING_LOW  (via drill 0.6 pad 1.3)
  Top 0.61: v15.24,53.78 v15.24,57.15 | 40.64,26.67 v40.83,26.67 39.38,28.12 U3.27
  Bottom 0.61: IC5.7 15.24,53.98 | 15.24,53.98 v15.24,53.78 | R39.2 18.26,60.33 17.14,60.33 15.24,58.42 v15.24,57.15 | 15.24,53.98 33.02,53.98 40.64,46.35 40.64,26.86 v40.83,26.67
CHP_EN  (via drill 0.6 pad 1.3)
  Top 0.61: U3.3 16.19,39.47 14.93,39.47 13.34,37.88 | v13.34,37 13.34,37.88 | R5.1 13.27,37.95 13.34,37.88
  Bottom 0.61: v13.34,37 26.5,37 27.48,36.02 T2.3 27.48,21.42 28.57,20.32 PAD21.1
DTR
  Bottom 0.61: T1.2 32.55,34.27 R2.1 32.54,36.68 PAD11.1
EN_IR1
  Top 0.61: U3.26 38.55,26.85 39.52,25.88 R9.1
EN_IR2
  Top 0.61: R7.1 29.21,21.11 U3.23
GND  (via drill 0.6 pad 1.3)
  Top 0.61: PAD2.1 5.08,60.96 4.45,60.33 v4.45,57.78 2.54,55.88 2.54,53.85 2.36,53.68 2.36,46.99 | 2.54,46.99 2.58,46.95 | 2.58,46.95 3.17,46.95 | 3.17,46.95 U$1.5 2.58,46.96 2.58,46.95 | 2.54,46.92 2.58,46.95 | U3.39 24.77,35.59 | 2.36,46.99 2.36,42.84 2.54,42.67 2.54,40.64 v5.08,40.64 | 3.17,46.95 3.14,46.99 2.36,46.99 | U3.39 23.5,34.86 23.5,39.37 26.21,42.09 31.75,42.09 | 31.75,42.09 U3.38 | v5.08,40.64 5.08,45.31 5.25,45.49 D5.C | v5.08,37.27 v5.08,40.64 | U3.39 23.77,34.56 23.5,34.29 20.95,34.29 19.05,32.38 U3.15 19.05,22.23 v18.41,21.59 15.88,21.59 14.61,20.32 v9.63,20.32 | 31.75,42.09 31.75,46.35 34.7,49.3 C1.2 39.6,49.3 PAD16.1 PAD5.1 | T5.2 23.81,17.46 24.77,16.51 v29.84,16.51 31.11,16.51 | T4.2 32.07,17.46 31.11,16.51 | U3.1 17.57,43.39 | 17.57,43.39 21.8,47.62 24.13,47.62 27.3,50.8 v27.3,51.24 27.3,51.44 27.3,53.98 C13.- 26.95,54.89 IC8.1 | 31.11,16.51 31.75,15.88 v31.75,10.79 | C5.2 13.56,45.09 15.88,45.09 17.57,43.39
  Bottom 0.305: U1.3 33.66,13.97 | 33.66,13.97 33.02,13.97 | 33.66,13.97 40.01,13.97 40.16,13.97
  Bottom 0.61: R10.1 23.01,47.07 C2.2 | C2.2 C3.2 23.09,42.62 22.86,42.39 15.09,42.39 14.61,41.91 | IC5.3 5.71,55.24 4.45,56.52 v4.45,57.78 4.45,58.9 R15.1 | R3.1 7.93,47.16 T3.2 7.79,47.16 5.08,44.45 v5.08,40.64 | 15.24,42.55 16.66,43.97 R26.1 16.83,44.28 | IC7.7 IC7.8 19.05,26.04 19.05,22.23 | 4.29,31.6 4.45,31.75 | 15.24,42.55 10.16,37.47 5.08,37.47 | 14.61,41.91 | 14.61,41.91 15.24,42.55 | 15.24,42.55 | 5.08,37.47 4.93,37.31 | 5.08,37.47 v5.08,37.27 4.21,36.41 C6.2 4.21,32.46 R29.1 4.29,31.6 | C2.2 27.3,51.2 v27.3,51.24 | 21.35,23.1 R37.1 22.23,22.71 22.23,22.23 22.86,21.59 22.86,17.78 20.64,15.56 20.64,13.34 | 21.35,23.1 21.11,22.86 | v18.41,21.59 19.05,22.23 | 19.05,22.23 19.93,23.1 21.35,23.1 | IC7.9 9.63,23.5 9.63,22.23 | R42.2 40.16,13.97 40.16,16.43 C11.1 | 9.63,19.58 v9.63,20.32 | v9.63,20.32 9.63,22.23 | 40.01,13.97 33.02,13.97 32.38,13.97 31.75,14.61 29.84,14.61 | 4.29,31.6 R28.1 R27.1 R30.1 4.29,23.65 5.71,22.23 9.63,22.23 | R24.1 29.84,14.61 | 21.59,22.86 21.35,23.1 | 9.63,15.88 v9.63,20.32 | D2.P$1 9.64,15.88 9.63,15.88 | v31.75,10.79 24.13,3.17 10.79,3.17 9.63,4.34 9.63,15.88 | v29.84,16.51 29.84,14.61 | 20.64,13.34 20.64,8.57 20.09,8.03 C10.2 | R18.1 9.63,18.8 v9.63,20.32 | IC1.4 20.64,13.34
IO0  (via drill 0.6 pad 1.3)
  Top 0.61: v36.2,24.77 35.38,25.58 U3.25
  Bottom 0.61: R8.2 34.29,39.37 35.56,38.1 35.56,31.11 | 35.56,31.11 35.56,28.57 36.2,27.94 v36.2,24.77 36.2,23.5 35.56,22.86 PAD22.1 | T1.3 35.56,31.11
IR1_LED_ANODE
  Top 0.61: R6.1 PAD8.1
IR1_LED_CATHODE
  Top 0.61: PAD7.1 T4.3
IR2_LED_ANODE
  Top 0.61: R4.2 PAD10.1
IR2_LED_CATHODE
  Top 0.61: T5.3 PAD9.1
N$1
  Top 0.61: D5.A R40.1
N$3
  Top 0.61: T5.1 23.66,20.49 24.13,20.95 R7.2
N$4
  Bottom 0.61: R38.1 D3.A
N$5
  Bottom 0.61: R11.2 32.54,30.15 T1.1
N$6
  Bottom 0.61: R39.1 D4.A
N$7
  Bottom 0.61: IC1.2 D2.P$2 14.45,10.63 R12.1 14.38,7.54 C4.1
N$8
  Top 0.61: T4.1 35.41,20.95 R9.2
N$9
  Bottom 0.305: U1.1 35.7,12.55 36.83,11.43 R42.1
N$10
  Bottom 0.61: R18.2 R19.1 16.51,17.63 16.51,16.99 16.51,16.51 16.51,12.7 17.14,12.06 IC1.3
N$11
  Bottom 0.61: IC7.6 20.32,28.57 21.59,27.3 R37.2
N$13
  Bottom 0.61: R13.2 11.11,43.98 T3.1
N$18
  Bottom 0.61: T2.1 29.68,34.27 R2.2
N$29
  Bottom 0.61: R24.2 25.88,13.34 | 25.88,13.34 25.88,12.14 C8.1 | 25.88,13.34 IC1.5
N$39
  Bottom 0.61: 21.44,32.38 21.44,31.83 C9.1 21.59,31.52 21.59,30.48 24.13,27.94 24.13,16.51 21.59,13.97 21.59,12.7 22.23,12.06 IC1.6 | 21.44,32.38 R25.2 | IC7.3 21.44,32.38
N$40
  Bottom 0.61: IC7.13 10.52,31.11 8.89,29.49 8.89,27.3 R27.2
N$41
  Bottom 0.61: IC7.14 10.14,32.38 7.6,29.84 R28.2
N$42
  Bottom 0.61: IC7.15 9.53,33.66 8.26,32.38 R29.2
N$43
  Bottom 0.61: IC7.12 10.79,29.84 10.16,29.21 10.16,26.67 8.26,24.77 R30.2
PHOTODIODE_ADC
  Bottom 0.305: U1.4 32.9,12.55 U1.5 30.97,12.55
  Bottom 0.61: 32.9,12.55 30.97,12.55 29.3,12.55 C8.2 29.21,11.66 29.21,10.16 23.5,4.45 17.14,4.45 17.38,4.67 C4.2 17.38,7.54 R12.2 17.36,7.68 18.36,7.68 IC1.1
PPG_SIGNAL_ADC
  Bottom 0.305: U1.7 32.9,16.66
  Bottom 0.61: R25.1 24.36,34.85 C9.2 24.36,30.25 25.4,29.21 25.4,19.05 26.46,17.99 27.3,17.99 | 32.9,16.66 U1.6 31.32,17.99 27.3,17.99 | 27.3,17.99 27.3,10.79 IC1.7
PPG_SIGNAL_GAIN_A  (via drill 0.6 pad 1.3)
  Top 0.61: v13.38,22.23 13.38,25.44 14.79,26.85 U3.13
  Bottom 0.61: IC7.11 15.24,28.57 15.24,24.3 13.38,22.44 v13.38,22.23
PPG_SIGNAL_GAIN_B  (via drill 0.6 pad 1.3)
  Top 0.61: U3.10 16.19,30.58 14.93,30.58 14.19,29.84 12.7,29.84 10.16,27.3 3.17,27.3 2.54,26.67 2.54,23.5 3.17,22.86 v11.43,22.86
  Bottom 0.61: IC7.10 12.29,27.18 13.52,27.18 14.12,27.21 14.12,25.4 11.58,22.86 v11.43,22.86
R_PROG
  Bottom 0.61: IC5.2 4.93,53.98 R3.2
RTS
  Bottom 0.61: T2.2 29.69,30.15 R11.1 29.69,25.88 30.18,25.4 PAD15.1
SCL  (via drill 0.6 pad 1.3)
  Top 0.61: U3.36 37.47,39.55 | 37.47,39.55 38.28,39.55 38.73,40.01 PAD3.1 | 37.47,39.55 v37.47,40.64
  Bottom 0.305: U1.10 35.67,17.67 | 36.94,18.94 38.77,20.77
  Bottom 0.61: 35.67,17.67 36.94,18.94 39.37,21.37 39.37,39.37 38.1,40.64 v37.47,40.64 35.2,42.9 35.18,42.9 34.27,43.81 R43.1
SDA  (via drill 0.6 pad 1.3)
  Top 0.61: U3.33 36.02,35.74 37.78,33.97 | PAD4.1 39.37,32.38 37.78,33.97 | 37.78,33.97 37.78,33.15 v37.66,33.02
  Bottom 0.305: U1.9 34.16,18.41
  Bottom 0.61: v37.66,33.02 37.47,33.02 | v37.66,33.02 37.66,37.91 34.29,41.27 R44.1 | 34.16,18.41 37.66,21.92 v37.66,33.02
T7
  Top 0.61: U3.12 16.19,28.04 13.35,28.04 11.41,26.1 7.69,26.1 PAD17.1
T8
  Top 0.61: U3.8 12.24,33.2 10.79,31.75 PAD18.1
T9
  Top 0.61: U3.9 16.19,31.85 12.48,31.85 9.84,29.21 PAD14.1
V_BATT  (via drill 0.6 pad 1.3)
  Top 0.61: PAD1.1 11.43,60.96 v14.61,60.96 15.88,62.23 20.28,62.23 Q5.3
  Bottom 0.61: IC5.5 11.43,57.99 R16.2 14.45,60.81 v14.61,60.96
V_BATT_ADC  (via drill 0.6 pad 1.3)
  Top 0.61: U3.7 3.12,34.47 v2.3,33.66
  Bottom 0.61: R16.1 R15.2 6.19,63.5 1.32,63.5 1.32,34.63 v2.3,33.66 2.3,33.37
V_USB  (via drill 0.35, 0.6 pad 1.3)
  Top 0.406: U$1.1 6.61,49.57
  Top 0.61: U$1.1 6.99,49.56 6.99,52.22 8.26,53.49 8.89,53.49 | 18.04,52.71 D1.A 18.41,52.07 | 18.04,52.71 Q5.1 | 18.41,52.07 v16.51,52.07 14.49,52.07 13.19,53.37 9.65,53.37 R40.2 8.89,53.49 | 18.04,52.71 18.04,52.45 18.41,52.07 | 8.89,53.49 v8.89,58.42 8.26,59.05 8.26,66.04 8.83,66.61 14.03,66.61 v14.61,66.04 | v40.01,58.42 40.64,58.42
  Bottom 0.61: R14.1 R35.2 | R14.1 R10.2 20.17,47.07 C2.1 C3.1 | v16.51,52.07 16.66,51.92 R14.1 | IC5.4 8.89,57.99 v8.89,58.42 | D3.C D4.C 27.3,60.96 22.23,66.04 | 22.23,66.04 22.86,66.04 30.48,66.04 38.1,58.42 v40.01,58.42 | v14.61,66.04 22.23,66.04
V_USB_ADC  (via drill 0.6 pad 1.3)
  Top 0.61: U3.6 3.81,35.74 3.17,36.38 v3.17,38.73
  Bottom 0.61: R35.1 R26.2 13.82,43.03 9.53,38.73 v3.17,38.73
VIN
  Top 0.61: IC8.2 36.2,53.99 C1.1 37.23,52.3 38.1,51.44 PAD20.1
VIN_SW  (via drill 0.6 pad 1.3)
  Top 0.61: 22.6,54.98 Q5.2 | PAD19.1 40.01,55.24 v40.01,55.88 | D1.C 22.6,52.71 Q5.2 | Q5.2 22.6,55.62 24.13,57.15 24.13,63.5 24.77,64.14 v26.67,64.14
  Bottom 0.61: v40.01,55.88 37.47,55.88 29.21,64.14 v26.67,64.14
(copper drawn outside any net)
  shapes: Top area x2